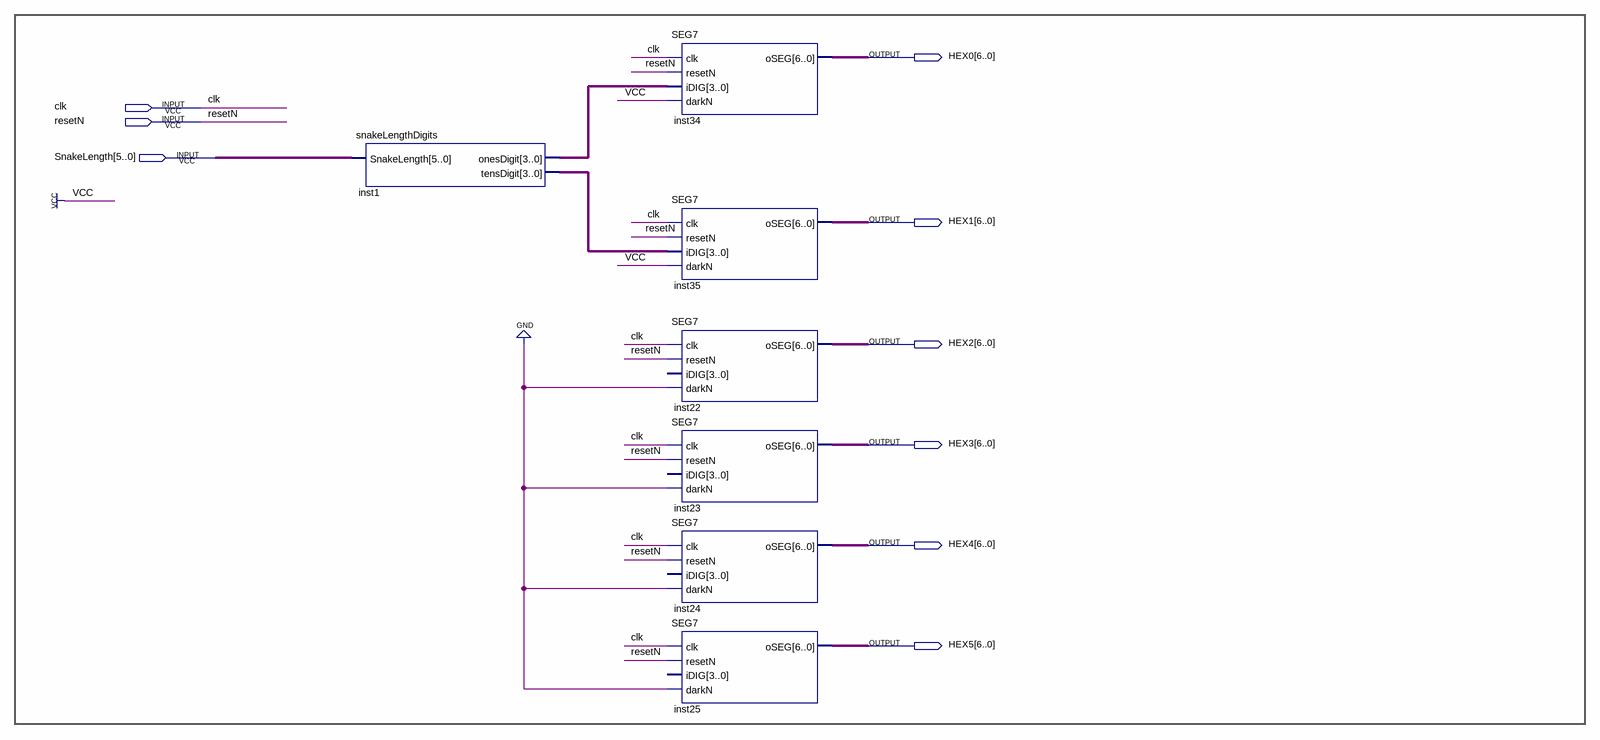
[diagram p0: schematic sheet]
// Quartus schematic Hex_Block.bdf as structural Verilog: 7 symbols, 9 pins
module Hex_Block (
  input  clk,
  input  resetN,
  input  [5:0] SnakeLength,
  output [6:0] HEX0,
  output [6:0] HEX1,
  output [6:0] HEX2,
  output [6:0] HEX3,
  output [6:0] HEX4,
  output [6:0] HEX5
);

  wire [3:0] inst1_onesdigit, inst1_tensdigit;

  snakeLengthDigits inst1 (.SnakeLength(SnakeLength), .onesDigit(inst1_onesdigit), .tensDigit(inst1_tensdigit));
  SEG7 inst34 (.clk(clk), .resetN(resetN), .iDIG(inst1_onesdigit), .darkN(1'b1), .oSEG(HEX0));
  SEG7 inst35 (.clk(clk), .resetN(resetN), .iDIG(inst1_tensdigit), .darkN(1'b1), .oSEG(HEX1));
  SEG7 inst22 (.clk(clk), .resetN(resetN), .darkN(1'b0), .oSEG(HEX2));  // open: iDIG
  SEG7 inst23 (.clk(clk), .resetN(resetN), .darkN(1'b0), .oSEG(HEX3));  // open: iDIG
  SEG7 inst24 (.clk(clk), .resetN(resetN), .darkN(1'b0), .oSEG(HEX4));  // open: iDIG
  SEG7 inst25 (.clk(clk), .resetN(resetN), .darkN(1'b0), .oSEG(HEX5));  // open: iDIG
endmodule
